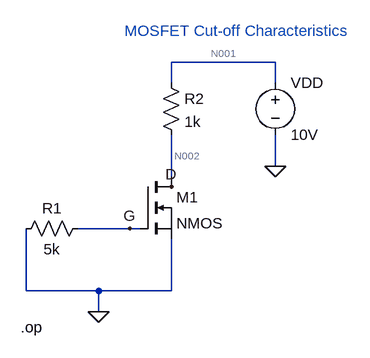
[diagram p0: schematic 10 Mosfet switching cut off characteristics.asc]
10 Mosfet switching cut off characteristics.asc, the LTspice schematic file:
Version 4
SHEET 1 880 680
WIRE 480 -16 320 -16
WIRE 320 16 320 -16
WIRE 480 16 480 -16
WIRE 480 144 480 96
WIRE 320 160 320 96
WIRE 256 240 176 240
WIRE 272 240 256 240
WIRE 96 336 96 240
WIRE 208 336 96 336
WIRE 320 336 320 256
WIRE 320 336 208 336
WIRE 208 368 208 336
FLAG 208 368 0
FLAG 480 144 0
FLAG 256 240 G
FLAG 320 176 D
SYMBOL res 192 224 R90
WINDOW 0 0 56 VBottom 2
WINDOW 3 32 56 VTop 2
SYMATTR InstName R1
SYMATTR Value 5k
SYMBOL nmos 272 160 R0
SYMATTR InstName M1
SYMBOL res 304 0 R0
SYMATTR InstName R2
SYMATTR Value 1k
SYMBOL voltage 480 0 R0
WINDOW 123 0 0 Left 0
WINDOW 39 0 0 Left 0
SYMATTR InstName VDD
SYMATTR Value 10V
TEXT 88 392 Left 2 !.op
TEXT 248 -64 Left 2 ;MOSFET Cut-off Characteristics

The netlist it stands for:
* 10 Mosfet switching cut off characteristics.asc
R1 G 0 5k
M1 N002 G 0 0 NMOS
R2 N001 N002 1k
VDD N001 0 10V
.model NMOS NMOS
.model PMOS PMOS
.lib standard.mos
.op
* MOSFET Cut-off Characteristics
.backanno
.end

* Results of the author's LTspice run, read from the files saved beside the schematic
* Operating Point:
*   V(g) = 0 V
*   V(n002) = 10 V
*   V(n001) = 10 V
*   Id(M1) = 20.01 pA
*   Ig(M1) = 0 A
*   Ib(M1) = -10.01 pA
*   Is(M1) = -10 pA
*   I(R2) = 20.01 pA
*   I(R1) = 0 A
*   I(Vdd) = -20.01 pA
* From the log:
*   Semiconductor Device Operating Points:
*                           --- MOSFET Transistors ---
*   Name:          m1
*   Model:        nmos
*   Id:          2.00e-11
*   Vgs:         0.00e+00
*   Vds:         1.00e+01
*   Vbs:         0.00e+00
*   Vth:         0.00e+00
*   Vdsat:       0.00e+00
*   Gm:          0.00e+00
*   Gds:         0.00e+00
*   Gmb:         0.00e+00
*   Cbd:         0.00e+00
*   Cbs:         0.00e+00
*   Cgsov:       0.00e+00
*   Cgdov:       0.00e+00
*   Cgbov:       0.00e+00
*   Cgs:         0.00e+00
*   Cgd:         0.00e+00
*   Cgb:        -0.00e+00